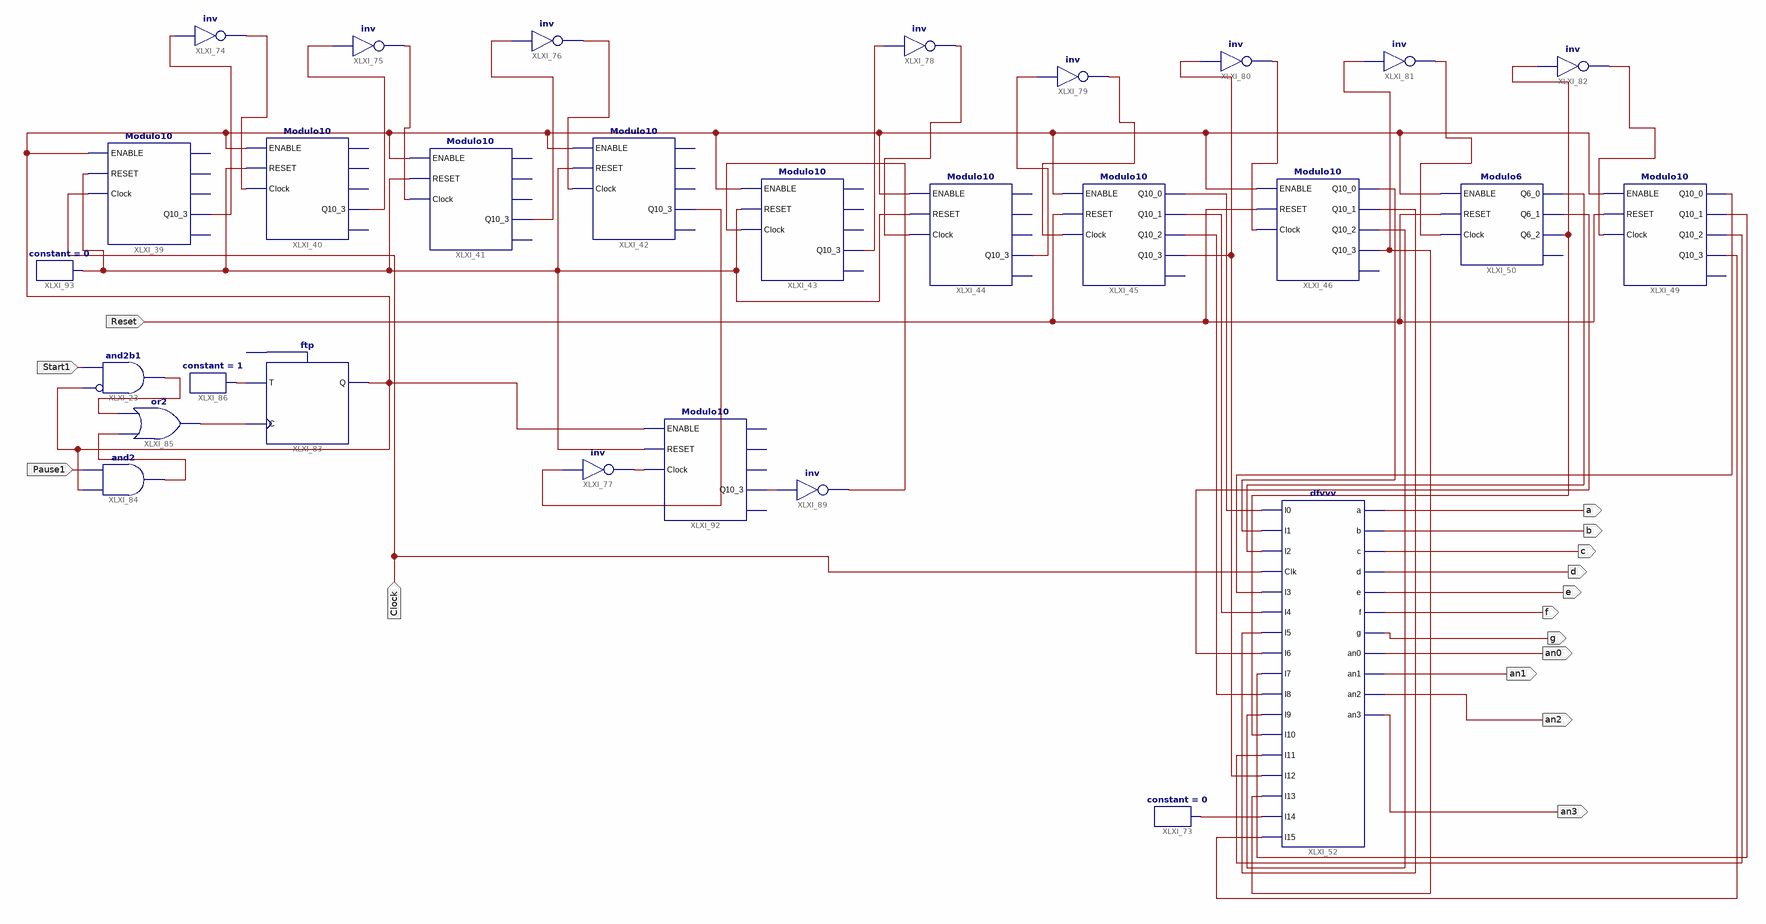
[diagram p0: schematic sheet 1]
// Xilinx ISE schematic Assign5.sch (spartan6) as structural Verilog: 29 symbols, 15 ports
module Assign5 (
  input  Start1,
  input  Pause1,
  input  Clock,
  input  Reset,
  output a,
  output b,
  output c,
  output d,
  output e,
  output f,
  output g,
  output an0,
  output an1,
  output an2,
  output an3
);

  wire XLXN_145, XLXN_149, XLXN_151, XLXN_162, XLXN_166, XLXN_170, XLXN_172, XLXN_189, XLXN_204, XLXN_228,
       XLXN_229, XLXN_231, XLXN_232, XLXN_233, XLXN_236, XLXN_239, XLXN_240, XLXN_241, XLXN_242, XLXN_244,
       XLXN_245, XLXN_246, XLXN_248, XLXN_250, XLXN_251, XLXN_252, XLXN_253, XLXN_254, XLXN_258, XLXN_259,
       XLXN_260, XLXN_261, XLXN_265, XLXN_269, XLXN_281, XLXN_286, XLXN_287, XLXN_295, XLXN_297;

  and XLXI_23 (XLXN_258, ~XLXN_281, Start1);  // and2b1
  Modulo10 XLXI_39 (
    .Clock(Clock), .ENABLE(XLXN_281), .Q10_3(XLXN_245), .RESET(XLXN_295));  // open: EoC10, Q10_0, Q10_1, Q10_2
  Modulo10 XLXI_41 (
    .Clock(XLXN_149), .ENABLE(XLXN_281), .Q10_3(XLXN_248), .RESET(XLXN_295));  // open: EoC10, Q10_0, Q10_1, Q10_2
  Modulo10 XLXI_42 (
    .Clock(XLXN_151), .ENABLE(XLXN_281), .Q10_3(XLXN_286), .RESET(XLXN_295));  // open: EoC10, Q10_0, Q10_1, Q10_2
  Modulo10 XLXI_43 (
    .Clock(XLXN_269), .ENABLE(XLXN_281), .Q10_3(XLXN_250), .RESET(XLXN_295));  // open: EoC10, Q10_0, Q10_1, Q10_2
  Modulo10 XLXI_44 (
    .Clock(XLXN_204), .ENABLE(XLXN_281), .Q10_3(XLXN_251), .RESET(XLXN_295));  // open: EoC10, Q10_0, Q10_1, Q10_2
  Modulo10 XLXI_45 (
    .Clock(XLXN_162), .ENABLE(XLXN_281), .Q10_0(XLXN_189), .Q10_1(XLXN_228), .Q10_2(XLXN_229),
    .Q10_3(XLXN_252), .RESET(Reset));  // open: EoC10
  Modulo10 XLXI_49 (
    .Clock(XLXN_172), .ENABLE(XLXN_281), .Q10_0(XLXN_239), .Q10_1(XLXN_240), .Q10_2(XLXN_241),
    .Q10_3(XLXN_242), .RESET(Reset));  // open: EoC10
  Modulo6 XLXI_50 (
    .Clock(XLXN_170), .ENABLE(XLXN_281), .Q6_0(XLXN_236), .Q6_1(XLXN_297), .Q6_2(XLXN_254), .RESET(Reset));  // open: EoC6
  dfvvv XLXI_52 (
    .a(a), .an0(an0), .an1(an1), .an2(an2), .an3(an3), .b(b), .c(c), .Clk(Clock), .d(d), .e(e), .f(f), .g(g),
    .I0(XLXN_189), .I1(XLXN_231), .I10(XLXN_254), .I11(XLXN_241), .I12(XLXN_252), .I13(XLXN_253),
    .I14(XLXN_244), .I15(XLXN_242), .I2(XLXN_236), .I3(XLXN_239), .I4(XLXN_228), .I5(XLXN_232),
    .I6(XLXN_297), .I7(XLXN_240), .I8(XLXN_229), .I9(XLXN_233));
  Modulo10 XLXI_40 (
    .Clock(XLXN_145), .ENABLE(XLXN_281), .Q10_3(XLXN_246), .RESET(XLXN_295));  // open: EoC10, Q10_0, Q10_1, Q10_2
  constant #(.CValue("0")) XLXI_73 (.O(XLXN_244));
  Modulo10 XLXI_46 (
    .Clock(XLXN_166), .ENABLE(XLXN_281), .Q10_0(XLXN_231), .Q10_1(XLXN_232), .Q10_2(XLXN_233),
    .Q10_3(XLXN_253), .RESET(Reset));  // open: EoC10
  not XLXI_74 (XLXN_145, XLXN_245);
  not XLXI_75 (XLXN_149, XLXN_246);
  not XLXI_76 (XLXN_151, XLXN_248);
  not XLXI_77 (XLXN_265, XLXN_286);
  not XLXI_78 (XLXN_204, XLXN_250);
  not XLXI_79 (XLXN_162, XLXN_251);
  not XLXI_80 (XLXN_166, XLXN_252);
  not XLXI_81 (XLXN_170, XLXN_253);
  not XLXI_82 (XLXN_172, XLXN_254);
  ftp XLXI_83 (.C(XLXN_260), .T(XLXN_261), .Q(XLXN_281));  // open: PRE
  and XLXI_84 (XLXN_259, XLXN_281, Pause1);
  or XLXI_85 (XLXN_260, XLXN_259, XLXN_258);
  constant #(.CValue("1")) XLXI_86 (.O(XLXN_261));
  not XLXI_89 (XLXN_269, XLXN_287);
  Modulo10 XLXI_92 (
    .Clock(XLXN_265), .ENABLE(XLXN_281), .Q10_3(XLXN_287), .RESET(XLXN_295));  // open: EoC10, Q10_0, Q10_1, Q10_2
  constant #(.CValue("0")) XLXI_93 (.O(XLXN_295));
endmodule
